# Altium schematic sheet Button_schem.SchDoc
size A; SheetNumber: 1; SheetTotal: 1
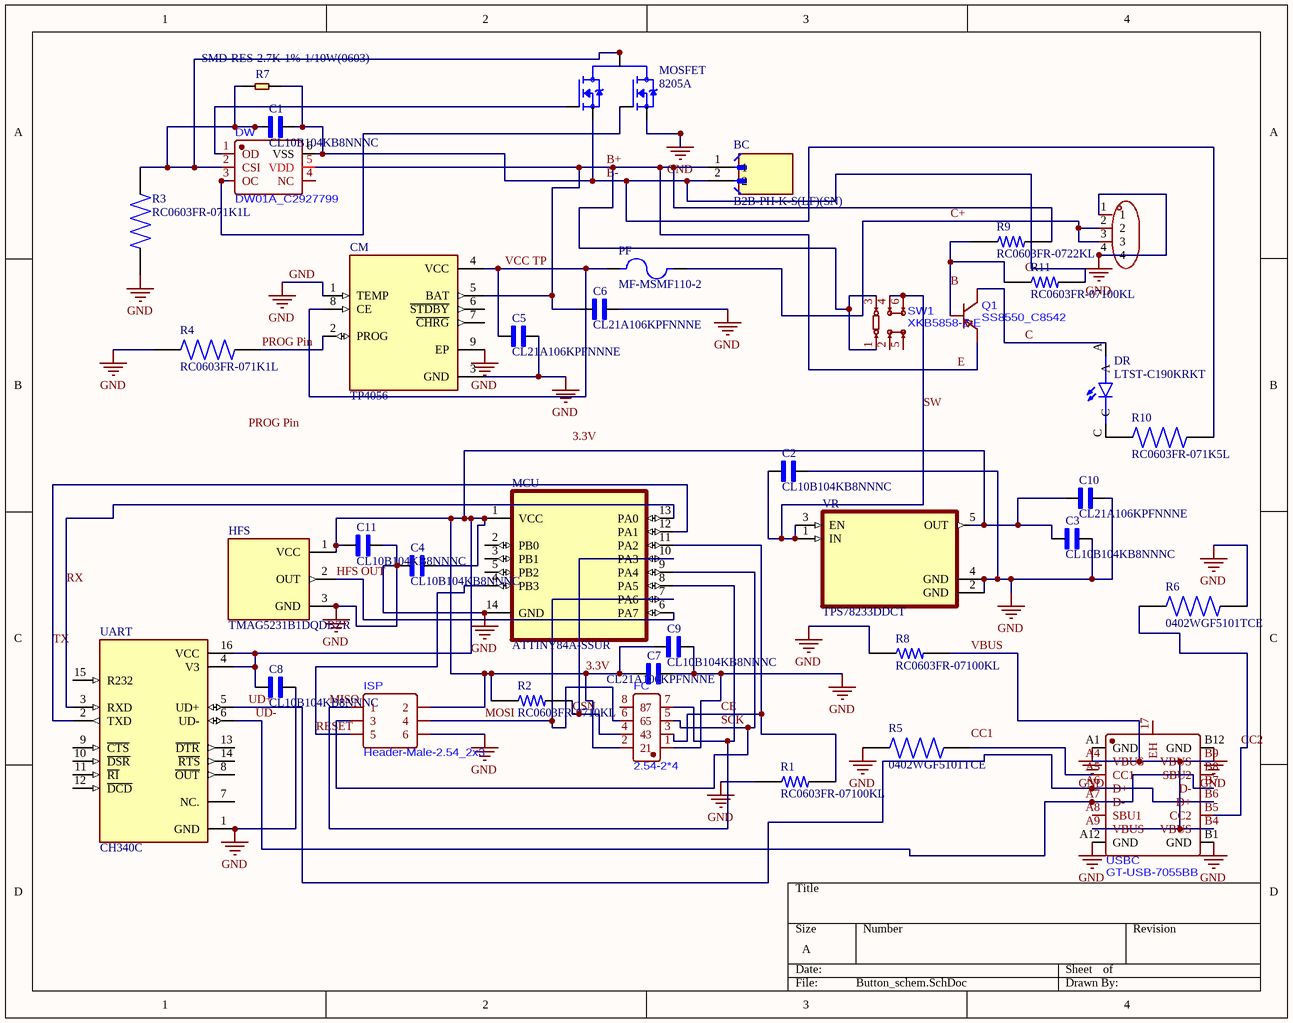
[diagram p0: Button_schem.SchDoc]

## Parts
BC  B2B-PH-K-S(LF)(SN)  [JST_B2B-PH-K-S(LF)(SN)]
C1  CL10B104KB8NNNC  [CAPC1608X90N]
C2  CL10B104KB8NNNC  [CAPC1608X90N]
C3  CL10B104KB8NNNC  [CAPC1608X90N]
C4  CL10B104KB8NNNC  [CAPC1608X90N]
C5  CL21A106KPFNNNE  [CAPC2012X135N]
C6  CL21A106KPFNNNE  [CAPC2012X135N]
C7  CL21A106KPFNNNE  [CAPC2012X135N]
C8  CL10B104KB8NNNC  [CAPC1608X90N]
C9  CL10B104KB8NNNC  [CAPC1608X90N]
C10  CL21A106KPFNNNE  [CAPC2012X135N]
C11  CL10B104KB8NNNC  [CAPC1608X90N]
CM  TP4056  [SOP127P600X175-9N]
DR  LTST-C190KRKT  [LEDC1608X35N]
DW  DW01A_C2927799  [SOT-23-6_L2.9-W1.6-P0.95-LS2.8-BL]
FC  2.54-2*4  [HDR-TH_8P-P2.54-V-F-R2-C4-S2.54]
HFS  TMAG5231B1DQDBZR  [SOT95P237X112-3N]
ISP  Header-Male-2.54_2x3  [HDR-TH_6P-P2.54-V-M-R2-C3-S2.54-1]
MC  YZ92015035T-04025-01  [CONN-SMD_4P-P2.50_YZ92015035T-04025-01]  (value not drawn)
MCU  ATTINY84A-SSUR  [SOIC127P600X175-14N]
MOSFET  8205A  [SOT95P285X140-6N]
PF  MF-MSMF110-2  [FUSER_MF-MSMF110-2]
Q1  SS8550_C8542  [SOT-23-3_L2.9-W1.3-P1.90-LS2.4-BR]
R1  RC0603FR-07100KL  [RESC1607X60N]
R2  RC0603FR-0710KL  [RESC1607X60N]
R3  RC0603FR-071K1L  [RESC1608X55N]
R4  RC0603FR-071K1L  [RESC1608X55N]
R5  0402WGF5101TCE  [RESC1005X40N]
R6  0402WGF5101TCE  [RESC1005X40N]
R7  SMD-RES-2.7K-1%-1/10W(0603)  [R0603]
R8  RC0603FR-07100KL  [RESC1607X60N]
R9  RC0603FR-0722KL  [RESC1607X60N]
R10  RC0603FR-071K5L  [RESC1607X60N]
R11  RC0603FR-07100KL  [RESC1607X60N]
SW1  XKB5858-Z-E  [SW-TH_XKB5858-Z-E]
UART  CH340C  [SOIC127P600X180-16N]
USBC  GT-USB-7055BB  [USB-C-TH_GT-USB-7055BB]
VR  TPS78233DDCT  [SOT95P280X110-5N]

## Nets
GND: C2.2 C3.2 C4.1 C5.2 C6.2 C7.2 C8.2 C9.2 C10.2 C11.2 CM.1(TEMP) CM.3(GND) CM.9(EP) FC.1 HFS.3(GND) ISP.6 MC.1 MC.4 MCU.14(GND) MOSFET.3(S2) R1.1 R3.1 R4.1 R5.1 R6.2 R8.1 UART.1(GND) USBC.A1(GND) USBC.A12(GND) USBC.B1(GND) USBC.B12(GND) VR.2(GND) VR.4(GND)
3.3V: C3.1 C4.2 C7.1 C8.1 C9.1 C10.1 C11.1 FC.2 HFS.1(VCC) ISP.2 MCU.1(VCC) R2.1 UART.4(V3) UART.16(VCC) VR.5(OUT)
B: Q1.1(B) R9.1 R11.1
B+: BC.1 C6.1 CM.5(BAT) DW.5(VDD) Q1.2(E) R9.2 SW1.1 SW1.3  [also labelled E]
B-: BC.2 C1.2 DW.6(VSS) MOSFET.1(S1) R7.2 R10.2 R11.2
C: DR.A Q1.3(C)
C+: MC.2 MC.3 PF.2
CC2: R6.1 USBC.B5(CC2)
CE: FC.3 MCU.11(PA2) R1.2
CSN: FC.4 MCU.10(PA3) R2.2
HFS OUT: HFS.2(OUT) MCU.6(PA7)
MISO: FC.7 ISP.1 MCU.8(PA5)
MOSI: FC.6 ISP.4 MCU.7(PA6)
PROG Pin: CM.2(PROG) R4.2
RESET: ISP.5 MCU.4(PB3)
RX: MCU.13(PA0) UART.3(RXD)
SCK: FC.5 ISP.3 MCU.9(PA4)
SW: C2.1 SW1.4 SW1.6 VR.1(IN) VR.3(EN)
TX: MCU.12(PA1) UART.2(TXD)
UD+: UART.5(UD+) USBC.A6(D+) USBC.B6(D+)
UD-: UART.6(UD-) USBC.A7(D-) USBC.B7(D-)
VBUS: R8.2 USBC.A4(VBUS) USBC.A9(VBUS) USBC.B4(VBUS) USBC.B9(VBUS)
VCC TP: C5.1 CM.4(VCC) CM.8(CE) PF.1
NetC1_1: C1.1 DW.2(CSI) MOSFET.2(D1_D2) MOSFET.5(D1_D2) R3.2 R7.1
NetDR_C: DR.C R10.1
NetDW_1: DW.1(OD) MOSFET.6(G1)
NetDW_3: DW.3(OC) MOSFET.4(G2)
NetR5_2: R5.2 USBC.A5(CC1)

Not connected (* = marked no-connect by the designer): CM 6(~{STDBY}) 7(~{CHRG}); DW 4(NC); FC 8; MCU 2(PB0) 3(PB1) 5(PB2); SW1 2 5; UART 7(NC.) 8(~{OUT}) 9(~{CTS}) 10(~{DSR}) 11(~{RI}) 12(~{DCD}) 13(~{DTR}) 14(~{RTS}) 15(R232); USBC 17(EH) A8(SBU1) B8(SBU2)

## Notes on the sheet
- Labels drawn without touching a wire or pin: 3.3V, C-, CC1, PROG Pin

## Library data of the parts
BC = B2B-PH-K-S(LF)(SN): Connector Header Through Hole 2 position 0.079 (2.00mm); MF: JST; SnapEDA_Link: https://www.snapeda.com/parts/B2B-PH-K-S%20(LF)(SN)/JST/view-part/?ref=snap; Package: None; Value: *; MP: B2B-PH-K-S (LF)(SN); Check_prices: https://www.snapeda.com/parts/B2B-PH-K-S%20(LF)(SN)/JST/view-part/?ref=eda
C1-C4 C8 C9 C11 = CL10B104KB8NNNC: 0.1 ÂµF Â±10% 50V Ceramic Capacitor X7R 0603 (1608 Metric); MF: Samsung Electro-Mechanics; SnapEDA_Link: https://www.snapeda.com/parts/CL10B104KB8NNNC/Samsung/view-part/?ref=snap; Package: SMD-2 Samsung; Value: *; MP: CL10B104KB8NNNC; Check_prices: https://www.snapeda.com/parts/CL10B104KB8NNNC/Samsung/view-part/?ref=eda
C5-C7 C10 = CL21A106KPFNNNE: 10 ÂµF Â±10% 10V Ceramic Capacitor X5R 0805 (2012 Metric); MF: Samsung; SnapEDA_Link: https://www.snapeda.com/parts/CL21A106KPFNNNE/Samsung/view-part/?ref=snap; Package: SMD-2 Samsung; Value: *; MP: CL21A106KPFNNNE; Check_prices: https://www.snapeda.com/parts/CL21A106KPFNNNE/Samsung/view-part/?ref=eda
CM = TP4056: Complete single cell Li-Ion battery with a constant current / constant voltage linear charger; MF: NanJing Top Power ASIC Corp.; Check_prices: https://www.snapeda.com/parts/TP4056/NanJing+Top+Power+ASIC+Corp./view-part/?ref=eda; SnapEDA_Link: https://www.snapeda.com/parts/TP4056/NanJing+Top+Power+ASIC+Corp./view-part/?ref=snap; Price: None; Availability: Not in stock; Package: Package; MP: TP4056; Value: *
DR = LTST-C190KRKT: Red 631nm LED Indication - Discrete 2V 0603 (1608 Metric); MF: Lite-On Inc.; Check_prices: https://www.snapeda.com/parts/LTST-C190KRKT/Lite-On+Inc./view-part/?ref=eda; Value: *; Purchase-URL: https://pricing.snapeda.com/search/part/LTST-C190KRKT/?ref=eda; Price: None; MP: LTST-C190KRKT; SnapEDA_Link: https://www.snapeda.com/parts/LTST-C190KRKT/Lite-On+Inc./view-part/?ref=snap; Availability: In Stock; Package: 0603 Lite-On
HFS = TMAG5231B1DQDBZR: Low-power, low-voltage (1.65 V to 5.5 V) Hall-effect switch; MF: Texas Instruments; SnapEDA_Link: https://www.snapeda.com/parts/TMAG5231B1DQDBZR/Texas+Instruments/view-part/?ref=snap; Package: SOT-23 Texas Instruments; Value: *; MP: TMAG5231B1DQDBZR; Check_prices: https://www.snapeda.com/parts/TMAG5231B1DQDBZR/Texas+Instruments/view-part/?ref=eda
MC = YZ92015035T-04025-01: Add into BOM: yes; Symbol: YZ92015035T-04025-01; Device: YZ92015035T-04025-01; Convert to PCB: yes
MCU = ATTINY84A-SSUR: AVR AVRÂ® ATtiny Microcontroller IC 8-Bit 20MHz 8KB (4K x 16) FLASH 14-SOIC; MF: Microchip Technology; SnapEDA_Link: https://www.snapeda.com/parts/ATTINY84A-SSUR/Microchip/view-part/?ref=snap; Package: SOIC-14 Microchip; Value: *; MP: ATTINY84A-SSUR; Check_prices: https://www.snapeda.com/parts/ATTINY84A-SSUR/Microchip/view-part/?ref=eda
MOSFET = 8205A: Mosfet Array 20V 5A 830mW (Ta) Surface Mount SOT-23-6; MF: UMW; SnapEDA_Link: https://www.snapeda.com/parts/8205A/UMW/view-part/?ref=snap; Package: SOT-23-6 UMW; Value: *; MP: 8205A; Check_prices: https://www.snapeda.com/parts/8205A/UMW/view-part/?ref=eda
PF = MF-MSMF110-2: Polymeric PTC Resettable Fuse 6V 1.1 A Ih Surface Mount 1812 (4532 Metric), Concave; MF: Bourns; SnapEDA_Link: https://www.snapeda.com/parts/MF-MSMF110-2/Bourns/view-part/?ref=snap; Purchase-URL: https://pricing.snapeda.com/search/part/MF-MSMF110-2/?ref=eda; MP: MF-MSMF110-2; Availability: In Stock; Package: 1812 Bourns; Check_prices: https://www.snapeda.com/parts/MF-MSMF110-2/Bourns/view-part/?ref=eda; Price: None; Value: *
R1 R8 R11 = RC0603FR-07100KL: 100 kOhms Â±1% 0.1W, 1/10W Chip Resistor 0603 (1608 Metric) Moisture Resistant Thick Film; MF: Yageo; SnapEDA_Link: https://www.snapeda.com/parts/RC0603FR-07100KL/Yageo/view-part/?ref=snap; Package: 0603 Yageo; Value: *; MP: RC0603FR-07100KL; Check_prices: https://www.snapeda.com/parts/RC0603FR-07100KL/Yageo/view-part/?ref=eda
R2 = RC0603FR-0710KL: 10 kOhms Â±1% 0.1W, 1/10W Chip Resistor 0603 (1608 Metric) Moisture Resistant Thick Film; MF: Yageo; SnapEDA_Link: https://www.snapeda.com/parts/RC0603FR-0710KL/Yageo/view-part/?ref=snap; Package: 0603 Yageo; Value: *; MP: RC0603FR-0710KL; Check_prices: https://www.snapeda.com/parts/RC0603FR-0710KL/Yageo/view-part/?ref=eda
R3 R4 = RC0603FR-071K1L: 1.1 kOhms Â±1% 0.1W, 1/10W Chip Resistor 0603 (1608 Metric) Moisture Resistant Thick Film; MF: Yageo; SnapEDA_Link: https://www.snapeda.com/parts/RC0603FR-071K1L/Yageo/view-part/?ref=snap; Package: 1608 Yageo; Value: *; MP: RC0603FR-071K1L; Check_prices: https://www.snapeda.com/parts/RC0603FR-071K1L/Yageo/view-part/?ref=eda
R5 R6 = 0402WGF5101TCE: 5.1K Ohm 1/16W Thick Film Resistor 0402 Chip - Surface Mount; MF: Uni-Royal; SnapEDA_Link: https://www.snapeda.com/parts/0402WGF5101TCE/Uni-Royal/view-part/?ref=snap; Package: None; Value: *; MP: 0402WGF5101TCE; Check_prices: https://www.snapeda.com/parts/0402WGF5101TCE/Uni-Royal/view-part/?ref=eda
R7 = SMD-RES-2.7K-1%-1/10W(0603): 2.7 kOhms Â±1% 0.1W, 1/10W Chip Resistor 0603 (1608 Metric) Moisture Resistant Thick Film; MF: Yageo; MP: RC0603FR-072K7L; SnapEDA_Link: https://www.snapeda.com/parts/RC0603FR-072K7L/Yageo/view-part/?ref=snap; Package: 0603 Yageo; Value: *; Check_prices: https://www.snapeda.com/parts/RC0603FR-072K7L/Yageo/view-part/?ref=eda
R9 = RC0603FR-0722KL: 22 kOhms Â±1% 0.1W, 1/10W Chip Resistor 0603 (1608 Metric) Moisture Resistant Thick Film; MF: Yageo; SnapEDA_Link: https://www.snapeda.com/parts/RC0603FR-0722KL/Yageo/view-part/?ref=snap; Package: 0603 Yageo; Value: *; MP: RC0603FR-0722KL; Check_prices: https://www.snapeda.com/parts/RC0603FR-0722KL/Yageo/view-part/?ref=eda
R10 = RC0603FR-071K5L: 1.5 kOhms Â±1% 0.1W, 1/10W Chip Resistor 0603 (1608 Metric) Moisture Resistant Thick Film; MF: Yageo; SnapEDA_Link: https://www.snapeda.com/parts/RC0603FR-071K5L/Yageo/view-part/?ref=snap; Package: 0603 Yageo; Value: *; MP: RC0603FR-071K5L; Check_prices: https://www.snapeda.com/parts/RC0603FR-071K5L/Yageo/view-part/?ref=eda
UART = CH340C: USB to serial chip CH340; MF: WCH; Price: None; Availability: Not in stock; MP: CH340C; Package: None; SnapEDA_Link: https://www.snapeda.com/parts/CH340C/WCH/view-part/?ref=snap; Check_prices: https://www.snapeda.com/parts/CH340C/WCH/view-part/?ref=eda; Value: *
VR = TPS78233DDCT: 150-mA, nano-IQ, low-dropout voltage regulator with enable from -40Â°C to +125Â°C; MF: Texas Instruments; Value: *; SnapEDA_Link: https://www.snapeda.com/parts/TPS78233DDCT/Texas+Instruments/view-part/?ref=snap; MP: TPS78233DDCT; Purchase-URL: https://pricing.snapeda.com/search/part/TPS78233DDCT/?ref=eda; Check_prices: https://www.snapeda.com/parts/TPS78233DDCT/Texas+Instruments/view-part/?ref=eda; Availability: In Stock; Price: None; Package: SOT-23-THN-5 Texas Instruments